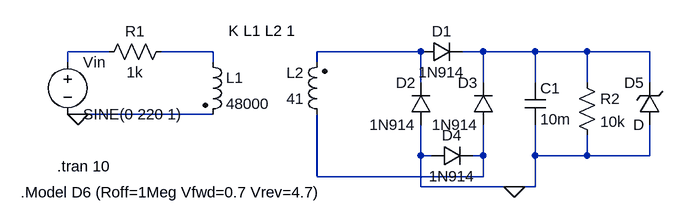
[diagram p0: schematic Project.asc]
Project.asc, the LTspice schematic file:
Version 4
SHEET 1 880 680
WIRE -96 144 -160 144
WIRE 64 144 -16 144
WIRE 384 144 224 144
WIRE 480 144 448 144
WIRE 560 144 480 144
WIRE 640 144 560 144
WIRE 736 144 640 144
WIRE -160 160 -160 144
WIRE 64 160 64 144
WIRE 224 160 224 144
WIRE 384 192 384 144
WIRE 480 192 480 144
WIRE 560 192 560 144
WIRE 640 192 640 144
WIRE 736 192 736 144
WIRE -144 240 -160 240
WIRE 64 240 -144 240
WIRE 384 304 384 256
WIRE 400 304 384 304
WIRE 480 304 480 256
WIRE 480 304 464 304
WIRE 560 304 560 256
WIRE 640 304 640 272
WIRE 640 304 560 304
WIRE 736 304 736 256
WIRE 736 304 640 304
WIRE 224 336 224 240
WIRE 480 336 480 304
WIRE 480 336 224 336
WIRE 384 352 384 304
WIRE 528 352 384 352
WIRE 560 352 560 304
WIRE 560 352 528 352
FLAG -144 240 0
FLAG 528 352 0
SYMBOL voltage -160 144 R0
WINDOW 123 0 0 Left 0
WINDOW 39 0 0 Left 0
SYMATTR InstName Vin
SYMATTR Value SINE(0 220 1)
SYMBOL ind2 48 144 R0
SYMATTR InstName L1
SYMATTR Value 48000
SYMATTR Type ind
SYMBOL ind2 240 256 R180
WINDOW 0 36 80 Left 2
WINDOW 3 36 40 Left 2
SYMATTR InstName L2
SYMATTR Value 41
SYMATTR Type ind
SYMBOL res 0 128 R90
WINDOW 0 0 56 VBottom 2
WINDOW 3 32 56 VTop 2
SYMATTR InstName R1
SYMATTR Value 1k
SYMBOL diode 384 160 R270
WINDOW 0 32 32 VTop 2
WINDOW 3 0 32 VBottom 2
SYMATTR InstName D1
SYMATTR Value 1N914
SYMBOL diode 400 256 R180
WINDOW 0 24 64 Left 2
WINDOW 3 24 0 Left 2
SYMATTR InstName D2
SYMATTR Value 1N914
SYMBOL diode 496 256 R180
WINDOW 0 24 64 Left 2
WINDOW 3 24 0 Left 2
SYMATTR InstName D3
SYMATTR Value 1N914
SYMBOL diode 400 320 R270
WINDOW 0 32 32 VTop 2
WINDOW 3 0 32 VBottom 2
SYMATTR InstName D4
SYMATTR Value 1N914
SYMBOL cap 544 192 R0
SYMATTR InstName C1
SYMATTR Value 10m
SYMBOL res 624 176 R0
SYMATTR InstName R2
SYMATTR Value 10k
SYMBOL zener 752 256 R180
WINDOW 0 24 64 Left 2
WINDOW 3 24 0 Left 2
SYMATTR InstName D5
TEXT -176 320 Left 2 !.tran 10
TEXT -232 360 Left 2 !.Model D6 (Roff=1Meg Vfwd=0.7 Vrev=4.7)
TEXT 88 112 Left 2 !K L1 L2 1

The netlist it stands for:
* Project.asc
Vin N001 0 SINE(0 220 1)
L1 N002 0 48000
L2 N005 N003 41
R1 N002 N001 1k
D1 N003 N004 1N914
D2 0 N003 1N914
D3 N005 N004 1N914
D4 0 N005 1N914
C1 N004 0 10m
R2 N004 0 10k
D5 0 N004 D
.model D D
.lib standard.dio
.tran 10
.Model D6 (Roff=1Meg Vfwd=0.7 Vrev=4.7)
K L1 L2 1
.backanno
.end